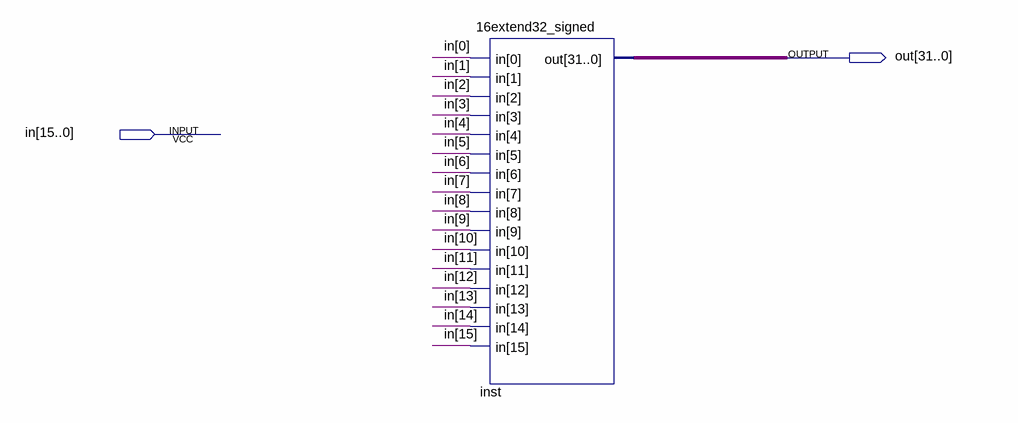
[diagram p0: schematic sheet]
// Quartus schematic 16extend32.bdf as structural Verilog: 1 symbols, 2 pins
module \16extend32  (
  input  [15:0] in,
  output [31:0] out
);

  \16extend32_signed  inst (.in(in), .out(out));
endmodule
